# Altium project PCB_Project_2.PrjPcb
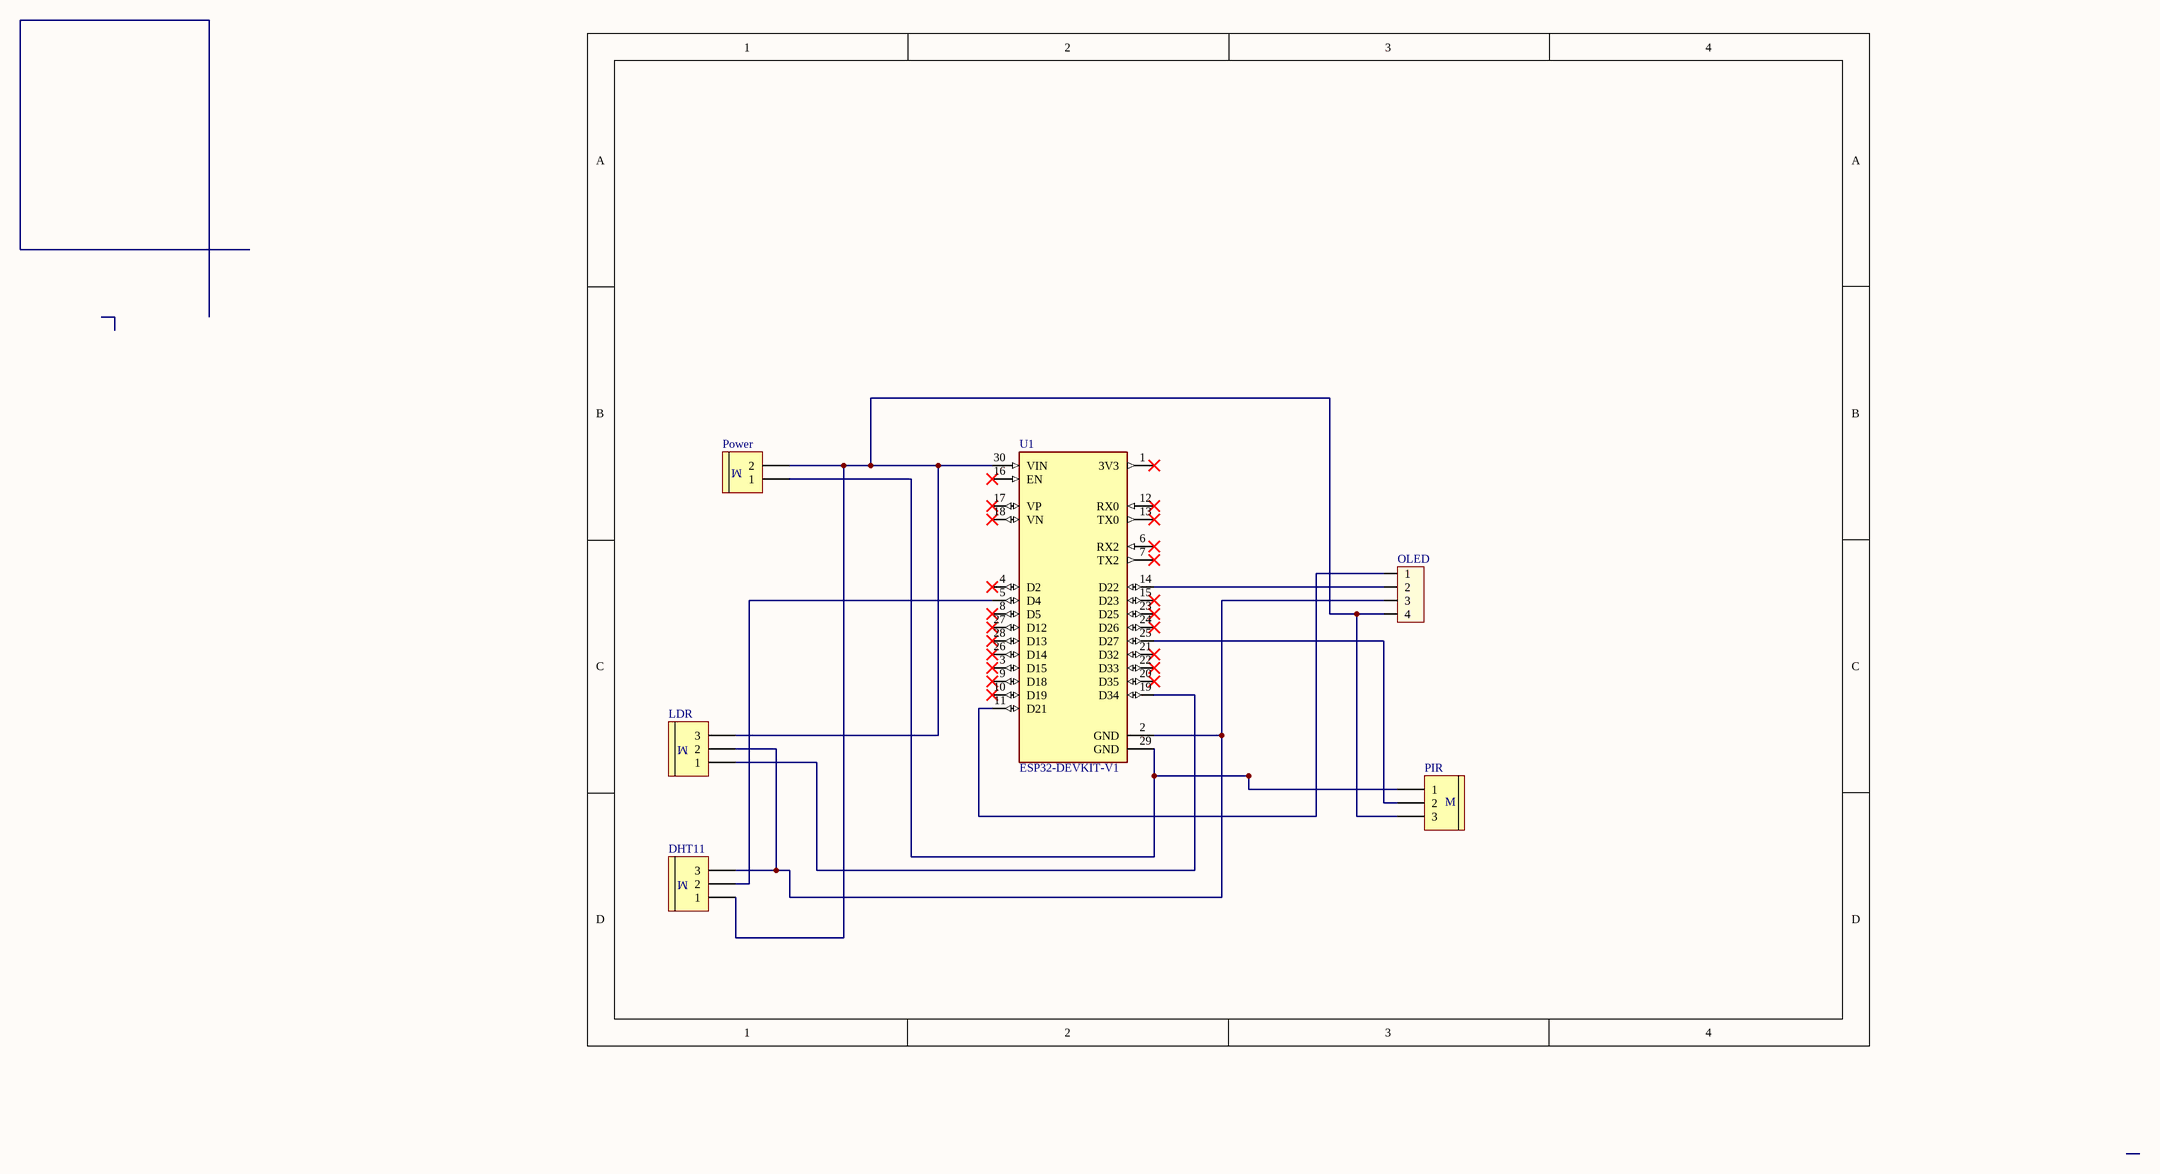
[diagram p0: schematic.SchDoc]
1 sheet, 6 parts. Net scope: global (net labels, ports and power ports of the same name join across sheets).
Board file: PCB1.PcbDoc

## Sheet schematic.SchDoc
size A; SheetNumber: 1; SheetTotal: 1

### Parts
DHT11  Header 3 - M  [Medium - Header 3]  (value not drawn)
LDR  Header 3 - M  [Medium - Header 3]  (value not drawn)
OLED  Header 4  [HED4]  (value not drawn)
PIR  Header 3 - M  [Medium - Header 3]  (value not drawn)
Power  Header 2 - M  [Medium - Header 2]  (value not drawn)
U1  ESP32-DEVKIT-V1  [MODULE_ESP32_DEVKIT_V1]

### Nets
NetDHT11_1: DHT11.1 LDR.3 OLED.4 PIR.3 Power.2 U1.30(VIN)
NetDHT11_2: DHT11.2 U1.5(D4)
NetDHT11_3: DHT11.3 LDR.2 OLED.3 U1.2(GND)
NetLDR_1: LDR.1 U1.19(D34)
NetOLED_1: OLED.1 U1.11(D21)
NetOLED_2: OLED.2 U1.14(D22)
NetPIR_1: PIR.1 Power.1 U1.29(GND)
NetPIR_2: PIR.2 U1.25(D27)

Not connected (* = marked no-connect by the designer): U1 1(3V3)* 3(D15)* 4(D2)* 6(RX2)* 7(TX2)* 8(D5)* 9(D18)* 10(D19)* 12(RX0)* 13(TX0)* 15(D23)* 16(EN)* 17(VP)* 18(VN)* 20(D35)* 21(D32)* 22(D33)* 23(D25)* 24(D26)* 26(D14)* 27(D12)* 28(D13)*

### Notes on the sheet
- (in symbol Header 2 - M) M
- (in symbol Header 3 - M) M

### Library data of the parts
DHT11 LDR PIR = Header 3 - M: Header, 3-Pin, Medium; LatestRevisionDate: 17-Jul-2002; LatestRevisionNote: Re-released for DXP Platform.; Publisher: Altium Limited
OLED = Hed4: Header 4 (Green); Value: Header 4
Power = Header 2 - M: Header, 2-Pin, Medium; LatestRevisionDate: 17-Jul-2002; LatestRevisionNote: Re-released for DXP Platform.; Publisher: Altium Limited
U1 = ESP32-DEVKIT-V1: Dual core, Wi-Fi: 2.4 GHz up to 150 Mbits/s,BLE (Bluetooth Low Energy) and legacy Bluetooth, 32 bits, Up to 240 MHz; MF: Do it; SnapEDA_Link: https://www.snapeda.com/parts/ESP32-DEVKIT-V1/Do+it/view-part/?ref=snap; Package: None; Value: *; MP: ESP32-DEVKIT-V1; Check_prices: https://www.snapeda.com/parts/ESP32-DEVKIT-V1/Do+it/view-part/?ref=eda